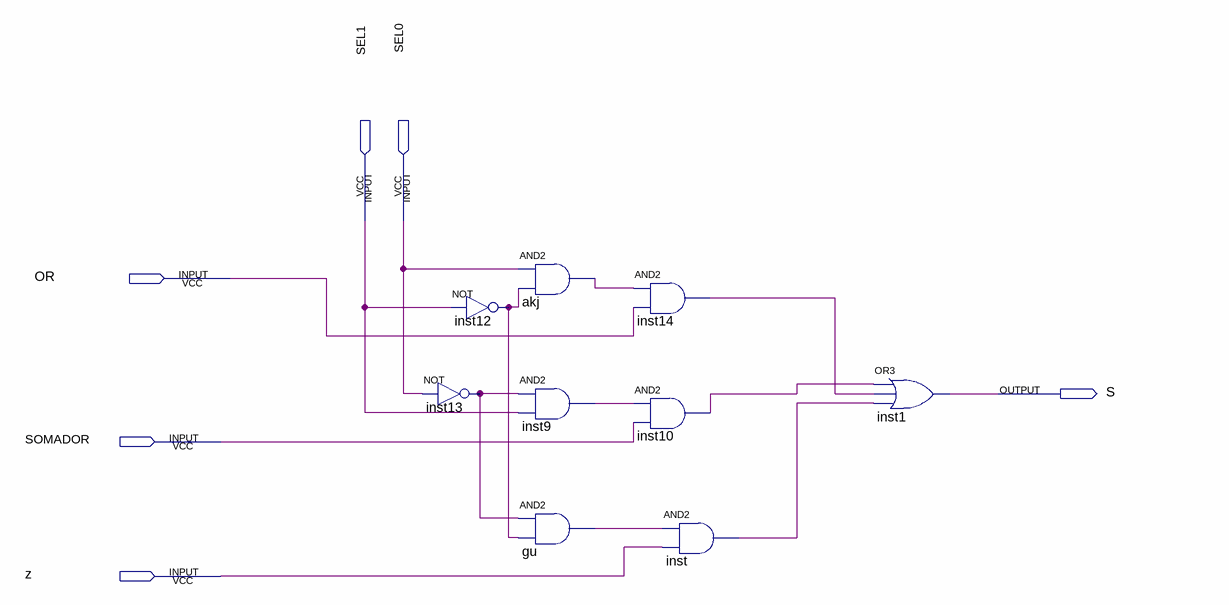
[diagram p0: schematic sheet]
// Quartus schematic Ulafinal.bdf as structural Verilog: 9 symbols, 6 pins
module Ulafinal (
  input  SEL1,
  input  SEL0,
  input  OR,
  input  SOMADOR,
  input  z,
  output S
);

  wire akj_out, gu_out, inst9_out, inst10_out, inst12_out, inst13_out, inst14_out, inst_out;

  not inst12 (inst12_out, SEL1);
  not inst13 (inst13_out, SEL0);
  and akj (akj_out, SEL0, inst12_out);
  and inst9 (inst9_out, inst13_out, SEL1);
  and gu (gu_out, inst13_out, inst12_out);
  and inst14 (inst14_out, akj_out, OR);
  and inst10 (inst10_out, inst9_out, SOMADOR);
  and inst (inst_out, gu_out, z);
  or inst1 (S, inst10_out, inst14_out, inst_out);
endmodule
